# Altium schematic sheet DM2080_Connector_A.SchDoc: =project_title
size Tabloid; CompanyName: Luxonis Holding; Organization: Luxonis Holding; Address1: 1925 Harmony Park Drive; Address2: Westminster, CO; Address3: 80234; Address4: United States; SheetNumber: 3; SheetTotal: 12
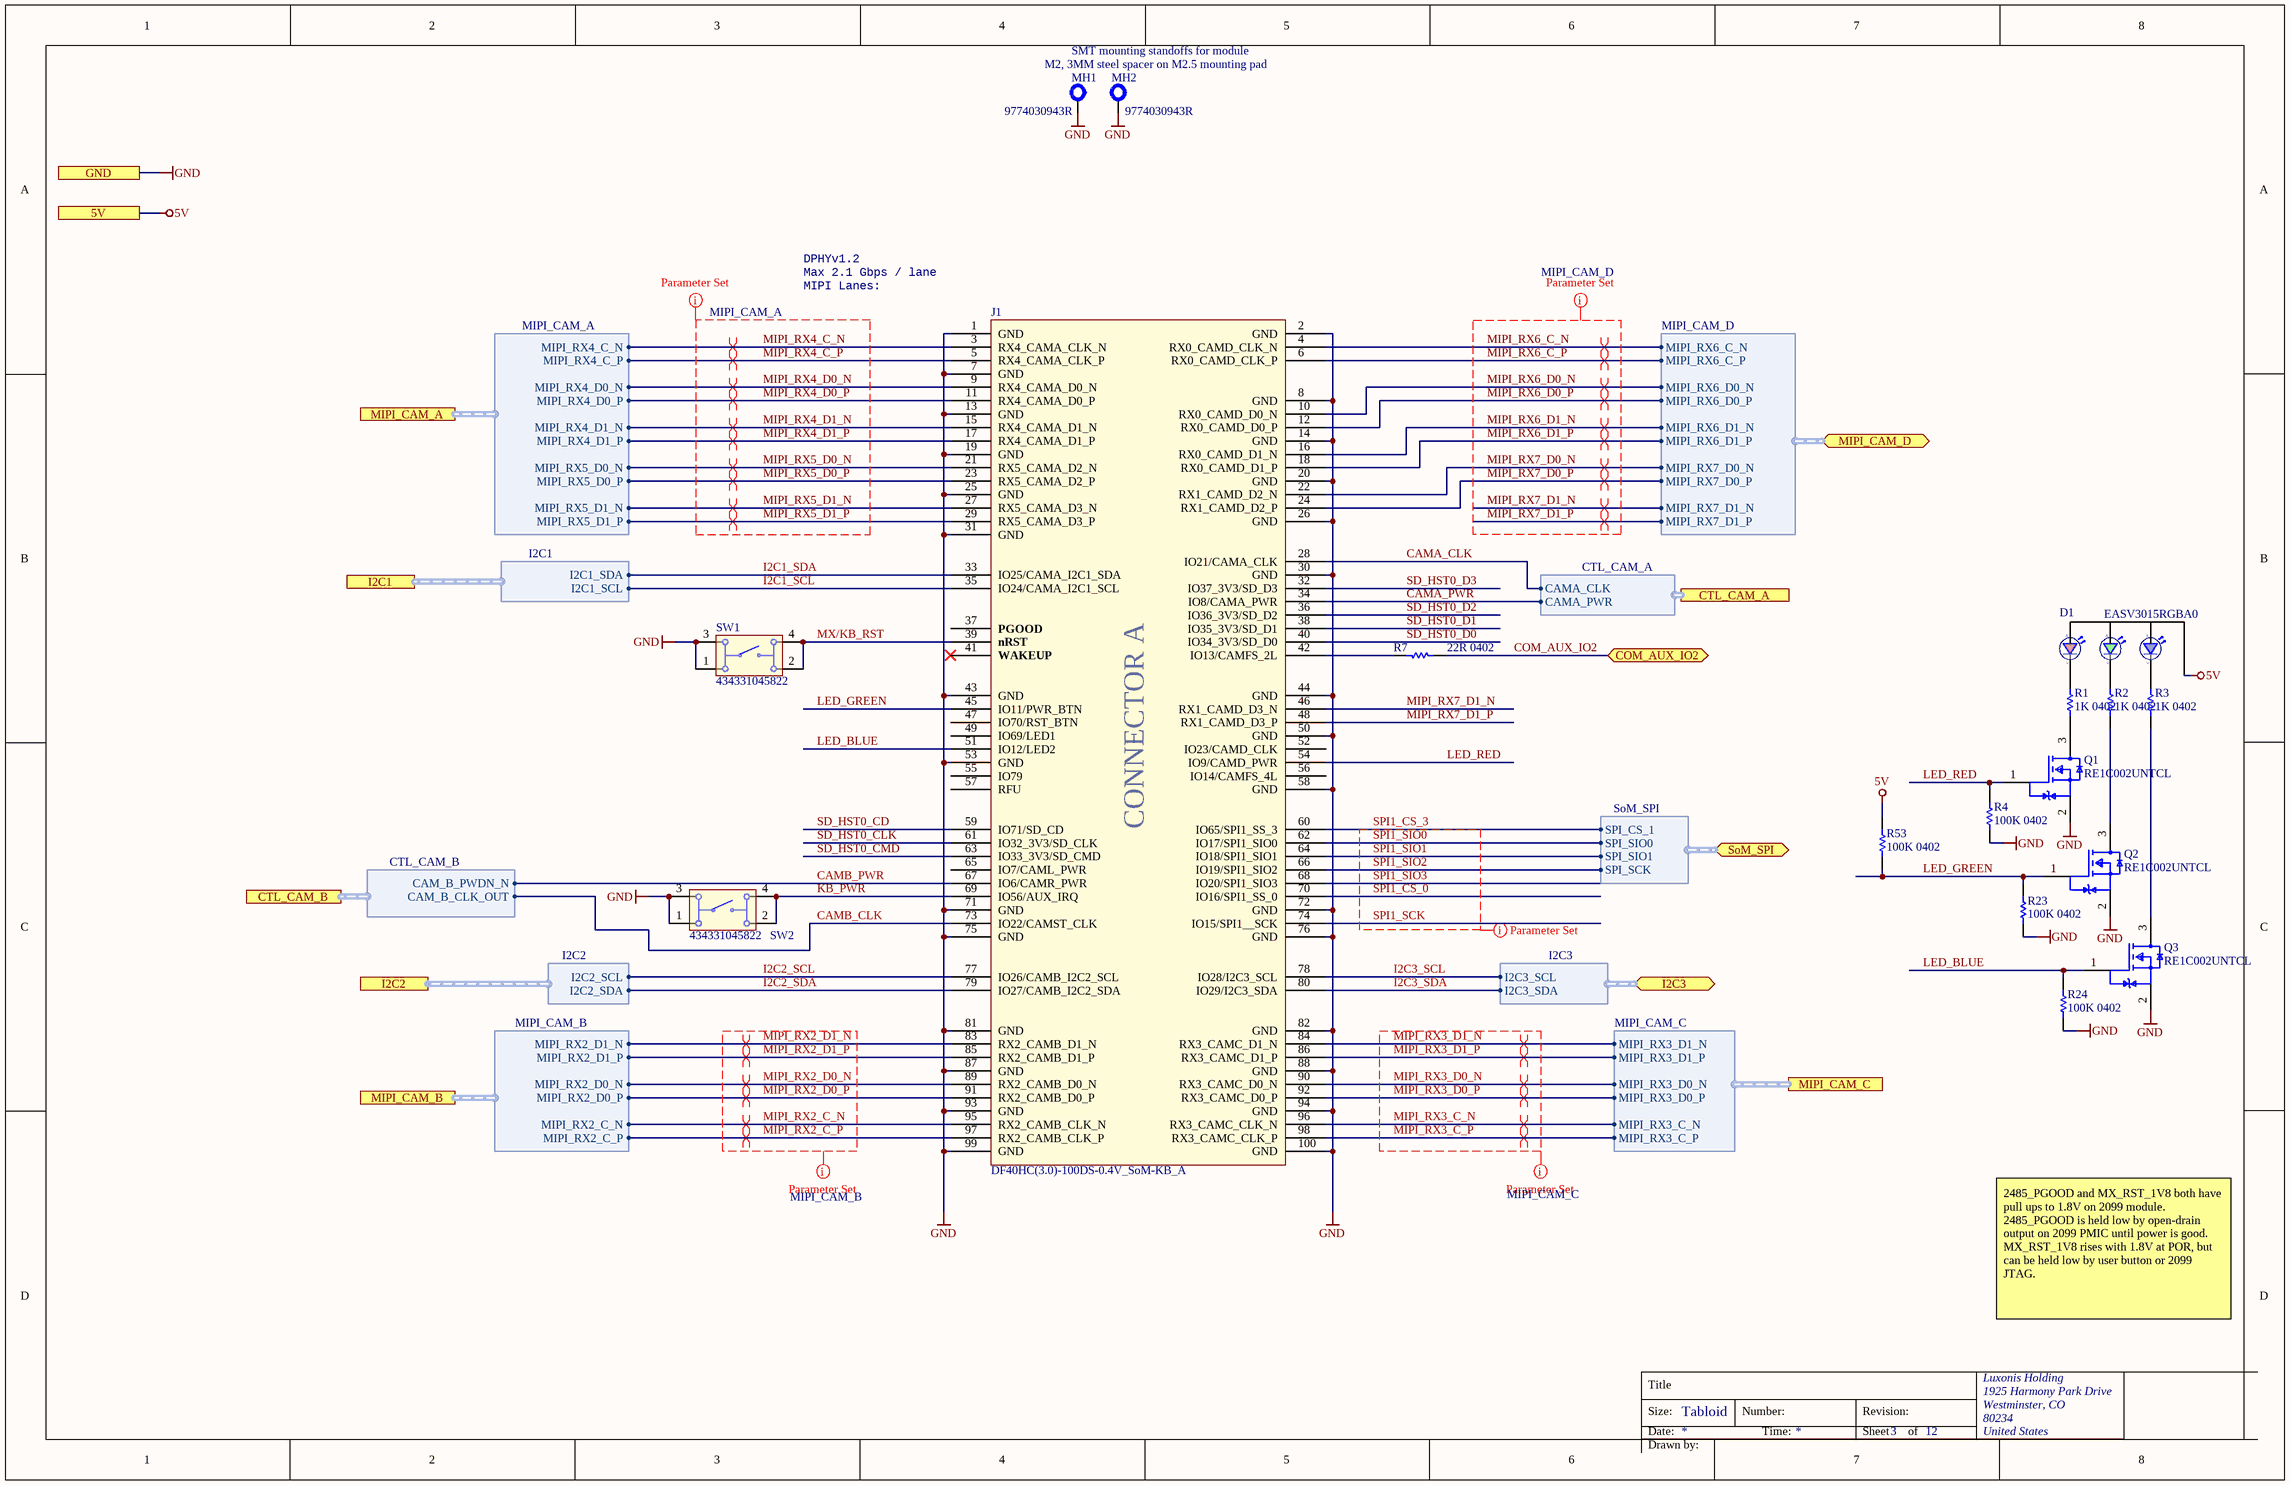
[diagram p0: DM2080_Connector_A.SchDoc]

## Parts
D1  EASV3015RGBA0  [EASV3015RGBA0]
J1  DF40HC(3.0)-100DS-0.4V_SoM-KB_A  [CON_A_SoM-Pro-KB_DF40HC-3.0-100DS-0.4V_minpad]
MH1  9774030943R  [9774030943R]
MH2  9774030943R  [9774030943R]
Q1  RE1C002UNTCL  [RE1C002UNTCL]
Q2  RE1C002UNTCL  [RE1C002UNTCL]
Q3  RE1C002UNTCL  [RE1C002UNTCL]
R1  1K 0402  [RESC0402(1005)_L]
R2  1K 0402  [RESC0402(1005)_L]
R3  1K 0402  [RESC0402(1005)_L]
R4  100K 0402  [RESC0402(1005)_L]
R7  22R 0402  [RESC0402(1005)_L]
R23  100K 0402  [RESC0402(1005)_L]
R24  100K 0402  [RESC0402(1005)_L]
R53  100K 0402  [RESC0402(1005)_L]
SW1  434331045822  [434331045822]
SW2  434331045822  [434331045822]

## Ports
5V, COM_AUX_IO2 (bidir), CTL_CAM_A (harness CTL_CAM_A), CTL_CAM_B (harness CTL_CAM_B), GND, I2C1 (harness I2C1), I2C2 (harness I2C2), I2C3 (bidir, harness I2C3), MIPI_CAM_A (harness MIPI_CAM_A), MIPI_CAM_B (harness MIPI_CAM_B), MIPI_CAM_C (harness MIPI_CAM_C), MIPI_CAM_D (bidir, harness MIPI_CAM_D), SoM_SPI (bidir, harness SoM_SPI)

## Harnesses
MIPI_CAM_B: MIPI_RX2_C_P, MIPI_RX2_C_N, MIPI_RX2_D0_P, MIPI_RX2_D0_N, MIPI_RX2_D1_P, MIPI_RX2_D1_N
MIPI_CAM_C: MIPI_RX3_C_P, MIPI_RX3_C_N, MIPI_RX3_D0_P, MIPI_RX3_D0_N, MIPI_RX3_D1_P, MIPI_RX3_D1_N
I2C1: I2C1_SDA, I2C1_SCL
CTL_CAM_B: CAM_B_CLK_OUT, CAM_B_PWDN_N
I2C2: I2C2_SDA, I2C2_SCL
MIPI_CAM_A: MIPI_RX4_C_P, MIPI_RX4_C_N, MIPI_RX4_D0_P, MIPI_RX4_D0_N, MIPI_RX4_D1_P, MIPI_RX4_D1_N, MIPI_RX5_D0_P, MIPI_RX5_D0_N, MIPI_RX5_D1_P, MIPI_RX5_D1_N
MIPI_CAM_D: MIPI_RX6_C_N, MIPI_RX6_C_P, MIPI_RX6_D0_N, MIPI_RX6_D0_P, MIPI_RX6_D1_N, MIPI_RX6_D1_P, MIPI_RX7_D0_N, MIPI_RX7_D0_P, MIPI_RX7_D1_N, MIPI_RX7_D1_P
I2C3: I2C3_SCL, I2C3_SDA
SoM_SPI: SPI_SIO0, SPI_SIO1, SPI_CS_1, SPI_SCK
CTL_CAM_A: CAMA_PWR, CAMA_CLK

## Nets
5V: D1.1(A) R53.1 ; port 5V
GND: J1.1(GND) J1.2(GND) J1.7(GND) J1.8(GND) J1.13(GND) J1.14(GND) J1.19(GND) J1.20(GND) J1.25(GND) J1.26(GND) J1.30(GND) J1.31(GND) J1.43(GND) J1.44(GND) J1.50(GND) J1.53(GND) J1.58(GND) J1.71(GND) J1.72(GND) J1.75(GND) J1.76(GND) J1.81(GND) J1.82(GND) J1.87(GND) J1.88(GND) J1.93(GND) J1.94(GND) J1.99(GND) J1.100(GND) MH1.1 MH2.1 Q1.2(Source) Q2.2(Source) Q3.2(Source) R4.2 R23.2 R24.2 SW1.1 SW1.3 SW2.1 SW2.3 ; port GND
CAMA_CLK: J1.28(IO21/CAMA_CLK) ; port CTL_CAM_A.CAMA_CLK
CAMA_PWR: J1.34(IO8/CAMA_PWR) ; port CTL_CAM_A.CAMA_PWR
CAMB_CLK: J1.73(IO22/CAMST_CLK) ; port CTL_CAM_B.CAM_B_CLK_OUT
CAMB_PWR: J1.67(IO6/CAMR_PWR) ; port CTL_CAM_B.CAM_B_PWDN_N
COM_AUX_IO2: R7.1 ; port COM_AUX_IO2
I2C1_SCL: J1.35(IO24/CAMA_I2C1_SCL) ; port I2C1.I2C1_SCL
I2C1_SDA: J1.33(IO25/CAMA_I2C1_SDA) ; port I2C1.I2C1_SDA
I2C2_SCL: J1.77(IO26/CAMB_I2C2_SCL) ; port I2C2.I2C2_SCL
I2C2_SDA: J1.79(IO27/CAMB_I2C2_SDA) ; port I2C2.I2C2_SDA
I2C3_SCL: J1.78(IO28/I2C3_SCL) ; port I2C3.I2C3_SCL
I2C3_SDA: J1.80(IO29/I2C3_SDA) ; port I2C3.I2C3_SDA
KB_PWR: J1.69(IO56/AUX_IRQ) SW2.2 SW2.4
LED_BLUE: J1.51(IO12/LED2) Q3.1(Gate) R24.1
LED_GREEN: J1.45(IO11/PWR_BTN) Q2.1(Gate) R23.1 R53.2
LED_RED: J1.54(IO9/CAMD_PWR) Q1.1(Gate) R4.1
MIPI_RX2_C_N: J1.95(RX2_CAMB_CLK_N) ; port MIPI_CAM_B.MIPI_RX2_C_N
MIPI_RX2_C_P: J1.97(RX2_CAMB_CLK_P) ; port MIPI_CAM_B.MIPI_RX2_C_P
MIPI_RX2_D0_N: J1.89(RX2_CAMB_D0_N) ; port MIPI_CAM_B.MIPI_RX2_D0_N
MIPI_RX2_D0_P: J1.91(RX2_CAMB_D0_P) ; port MIPI_CAM_B.MIPI_RX2_D0_P
MIPI_RX2_D1_N: J1.83(RX2_CAMB_D1_N) ; port MIPI_CAM_B.MIPI_RX2_D1_N
MIPI_RX2_D1_P: J1.85(RX2_CAMB_D1_P) ; port MIPI_CAM_B.MIPI_RX2_D1_P
MIPI_RX3_C_N: J1.96(RX3_CAMC_CLK_N) ; port MIPI_CAM_C.MIPI_RX3_C_N
MIPI_RX3_C_P: J1.98(RX3_CAMC_CLK_P) ; port MIPI_CAM_C.MIPI_RX3_C_P
MIPI_RX3_D0_N: J1.90(RX3_CAMC_D0_N) ; port MIPI_CAM_C.MIPI_RX3_D0_N
MIPI_RX3_D0_P: J1.92(RX3_CAMC_D0_P) ; port MIPI_CAM_C.MIPI_RX3_D0_P
MIPI_RX3_D1_N: J1.84(RX3_CAMC_D1_N) ; port MIPI_CAM_C.MIPI_RX3_D1_N
MIPI_RX3_D1_P: J1.86(RX3_CAMC_D1_P) ; port MIPI_CAM_C.MIPI_RX3_D1_P
MIPI_RX4_C_N: J1.3(RX4_CAMA_CLK_N) ; port MIPI_CAM_A.MIPI_RX4_C_N
MIPI_RX4_C_P: J1.5(RX4_CAMA_CLK_P) ; port MIPI_CAM_A.MIPI_RX4_C_P
MIPI_RX4_D0_N: J1.9(RX4_CAMA_D0_N) ; port MIPI_CAM_A.MIPI_RX4_D0_N
MIPI_RX4_D0_P: J1.11(RX4_CAMA_D0_P) ; port MIPI_CAM_A.MIPI_RX4_D0_P
MIPI_RX4_D1_N: J1.15(RX4_CAMA_D1_N) ; port MIPI_CAM_A.MIPI_RX4_D1_N
MIPI_RX4_D1_P: J1.17(RX4_CAMA_D1_P) ; port MIPI_CAM_A.MIPI_RX4_D1_P
MIPI_RX5_D0_N: J1.21(RX5_CAMA_D2_N) ; port MIPI_CAM_A.MIPI_RX5_D0_N
MIPI_RX5_D0_P: J1.23(RX5_CAMA_D2_P) ; port MIPI_CAM_A.MIPI_RX5_D0_P
MIPI_RX5_D1_N: J1.27(RX5_CAMA_D3_N) ; port MIPI_CAM_A.MIPI_RX5_D1_N
MIPI_RX5_D1_P: J1.29(RX5_CAMA_D3_P) ; port MIPI_CAM_A.MIPI_RX5_D1_P
MIPI_RX6_C_N: J1.4(RX0_CAMD_CLK_N) ; port MIPI_CAM_D.MIPI_RX6_C_N
MIPI_RX6_C_P: J1.6(RX0_CAMD_CLK_P) ; port MIPI_CAM_D.MIPI_RX6_C_P
MIPI_RX6_D0_N: J1.10(RX0_CAMD_D0_N) ; port MIPI_CAM_D.MIPI_RX6_D0_N
MIPI_RX6_D0_P: J1.12(RX0_CAMD_D0_P) ; port MIPI_CAM_D.MIPI_RX6_D0_P
MIPI_RX6_D1_N: J1.16(RX0_CAMD_D1_N) ; port MIPI_CAM_D.MIPI_RX6_D1_N
MIPI_RX6_D1_P: J1.18(RX0_CAMD_D1_P) ; port MIPI_CAM_D.MIPI_RX6_D1_P
MIPI_RX7_D0_N: J1.22(RX1_CAMD_D2_N) ; port MIPI_CAM_D.MIPI_RX7_D0_N
MIPI_RX7_D0_P: J1.24(RX1_CAMD_D2_P) ; port MIPI_CAM_D.MIPI_RX7_D0_P
MIPI_RX7_D1_N: J1.46(RX1_CAMD_D3_N) ; port MIPI_CAM_D.MIPI_RX7_D1_N
MIPI_RX7_D1_P: J1.48(RX1_CAMD_D3_P) ; port MIPI_CAM_D.MIPI_RX7_D1_P
MX/KB_RST: J1.39(nRST) SW1.2 SW1.4
SD_HST0_CD: J1.59(IO71/SD_CD)
SD_HST0_CLK: J1.61(IO32_3V3/SD_CLK)
SD_HST0_CMD: J1.63(IO33_3V3/SD_CMD)
SD_HST0_D0: J1.40(IO34_3V3/SD_D0)
SD_HST0_D1: J1.38(IO35_3V3/SD_D1)
SD_HST0_D2: J1.36(IO36_3V3/SD_D2)
SD_HST0_D3: J1.32(IO37_3V3/SD_D3)
SPI1_CS_0: J1.70(IO16/SPI1_SS_0)
SPI1_CS_3: J1.60(IO65/SPI1_SS_3) ; port SoM_SPI.SPI_CS_1
SPI1_SCK: J1.74(IO15/SPI1__SCK)
SPI1_SIO0: J1.62(IO17/SPI1_SIO0) ; port SoM_SPI.SPI_SIO0
SPI1_SIO1: J1.64(IO18/SPI1_SIO1) ; port SoM_SPI.SPI_SIO1
SPI1_SIO2: J1.66(IO19/SPI1_SIO2) ; port SoM_SPI.SPI_SCK
SPI1_SIO3: J1.68(IO20/SPI1_SIO3)
NetD1_2: D1.2(C) R3.2
NetD1_3: D1.3(C) R2.2
NetD1_4: D1.4(C) R1.2
NetJ1_42: J1.42(IO13/CAMFS_2L) R7.2
NetQ1_3: Q1.3(Drain) R1.1
NetQ2_3: Q2.3(Drain) R2.1
NetQ3_3: Q3.3(Drain) R3.1

Not connected (* = marked no-connect by the designer): J1 37(PGOOD) 41(WAKEUP)* 47(IO70/RST_BTN) 49(IO69/LED1) 52(IO23/CAMD_CLK) 55(IO79) 56(IO14/CAMFS_4L) 57(RFU) 65(IO7/CAML_PWR)

## Layout directives
net class MIPI_CAM_B; rule Matched Net Lengths [Delay Tolerance = 1ps]: MIPI_RX2_C_N, MIPI_RX2_C_P, MIPI_RX2_D0_N, MIPI_RX2_D0_P, MIPI_RX2_D1_N, MIPI_RX2_D1_P
differential pair; differential pair class 100ohm: MIPI_RX2_C_N, MIPI_RX2_C_P, MIPI_RX2_D0_N, MIPI_RX2_D0_P, MIPI_RX2_D1_N, MIPI_RX2_D1_P, MIPI_RX3_C_N, MIPI_RX3_C_P, MIPI_RX3_D0_N, MIPI_RX3_D0_P, MIPI_RX3_D1_N, MIPI_RX3_D1_P, MIPI_RX4_C_N, MIPI_RX4_C_P, MIPI_RX4_D0_N, MIPI_RX4_D0_P, MIPI_RX4_D1_N, MIPI_RX4_D1_P, MIPI_RX5_D0_N, MIPI_RX5_D0_P, MIPI_RX5_D1_N, MIPI_RX5_D1_P, MIPI_RX6_C_N, MIPI_RX6_C_P, MIPI_RX6_D0_N, MIPI_RX6_D0_P, MIPI_RX6_D1_N, MIPI_RX6_D1_P, MIPI_RX7_D0_N, MIPI_RX7_D0_P, MIPI_RX7_D1_N, MIPI_RX7_D1_P
net class MIPI_CAM_C; rule Matched Net Lengths [Delay Tolerance = 1ps]: MIPI_RX3_C_N, MIPI_RX3_C_P, MIPI_RX3_D0_N, MIPI_RX3_D0_P, MIPI_RX3_D1_N, MIPI_RX3_D1_P
net class SPI0: SPI1_CS_0, SPI1_CS_3, SPI1_SCK, SPI1_SIO0, SPI1_SIO1, SPI1_SIO2, SPI1_SIO3
net class MIPI_CAM_A; rule Matched Net Lengths [Delay Tolerance = 1ps]; rule Matched Net Lengths [Delay Tolerance = 0,5ps]: MIPI_RX4_C_N, MIPI_RX4_C_P, MIPI_RX4_D0_N, MIPI_RX4_D0_P, MIPI_RX4_D1_N, MIPI_RX4_D1_P, MIPI_RX5_D0_N, MIPI_RX5_D0_P, MIPI_RX5_D1_N, MIPI_RX5_D1_P
net class MIPI_CAM_D; rule Matched Net Lengths [Delay Tolerance = 1ps]; rule Matched Net Lengths [Delay Tolerance = 0,5ps]: MIPI_RX6_C_N, MIPI_RX6_C_P, MIPI_RX6_D0_N, MIPI_RX6_D0_P, MIPI_RX6_D1_N, MIPI_RX6_D1_P, MIPI_RX7_D0_N, MIPI_RX7_D0_P, MIPI_RX7_D1_N, MIPI_RX7_D1_P

## Notes on the sheet
- M2, 3MM steel spacer on M2.5 mounting pad
- SMT mounting standoffs for module
- MIPI Lanes:
- Max 2.1 Gbps / lane
- DPHYv1.2
- 2485_PGOOD and MX_RST_1V8 both have pull ups to 1.8V on 2099 module. 2485_PGOOD is held low by open-drain output on 2099 PMIC until power is good. MX_RST_1V8 rises with 1.8V at POR, but can be held low by user button or 2099 JTAG.
- Title
- Size:
- Date:
- Tabloid
- Number:
- Time:
- Revision:
- Sheet
- of
- Drawn by:
- (in symbol CMP-038-000000-5) CONNECTOR A

## Library data of the parts
D1 = EASV3015RGBA0: LED Tri-Color Blue/Green/Red 468nm/518nm/632nm 4-Pin SMD; Manufacturer 1: Everlight; Color: Blue,Green,Red; Lens Color: Colorless; Lens Transparency: Clear; Luminous Intensity: 50mcd; Test Current: 20mA; Viewing Angle: 100°; Dominant Wavelength: 470nm; Forward Voltage: 3.3V; Supplier 1: Future Electronics; RoHS: Yes; Category: LEDs; Mount: Surface Mount; Case/Package: SMD/SMT; Packaging: Tape and Reel; Length: 3mm; Width: 1.5mm; Height: 1.1mm; Lead Free: Lead Free; RoHS Compliant: Yes; ComponentLink1URL: https://everlightamericas.com/index.php?controller=attachment&id_attachment=1129&src-supplier=Digi-Key; ComponentLink1Description: https://everlightamericas.com/index.php?controller=attachment&id_attachment=1129&src-supplier=Digi-Key; ComponentLink2URL: https://everlightamericas.com/index.php?controller=attachment&amp;id_attachment=3220&src-supplier=Digi-Key; ComponentLink2Description: https://everlightamericas.com/index.php?controller=attachment&amp;id_attachment=3220&src-supplier=Digi-Key; ComponentLink3URL: https://everlightamericas.com/index.php?controller=attachment&id_attachment=3220&src-supplier=Digi-Key; ComponentLink3Description: https://everlightamericas.com/index.php?controller=attachment&id_attachment=3220&src-supplier=Digi-Key; Manufacturer Part Number 1: EASV3015RGBA0; Supplier Part Number 1: 9074476; Stock 1: 6000; Pricing 1: 2000=0,11600, 6000=0,09680, 10000=0,09580, 20000=0,09450, 40000=0,09310 (USD)
J1 = CMP-038-000000-5: OAK-SoM-Pro-S3 base board conn. A; Manufacturer 1: Hirose; Manufacturer Part Number 1: DF40HC(3.0)-100DS-0.4V(58); Pitch: 0.016inch; Number of Positions: 100; Connector Type: Receptacle; System: Connector; ComponentLink2URL: https://datasheet.ciiva.com/18562/ed-df40-20140305-18562189.pdf?src-supplier=Digi-Key; ComponentLink3Description: https://datasheet.ciiva.com/13559/ed-df40-20140305-13559540.pdf?src-supplier=Mouser; Packaging: Tape and Reel; Design Item ID: DF40HC(3.0)-100DS-0.4V_SoM-KB_A; Pricing 2: 1=2.50000, 10=2.40000, 25=2.10000, 50=2.10000, 100=2.00000, 250=1.76000, 500=1.71000, 1000=1.45000, 2000=1.36000, 5000=1.31000, 10000=1.31000 (USD); Package Quantity: 1000; Stock 2: 2078; Contact Plating: Gold; ComponentLink4Description: https://datasheet.ciiva.com/18562/ed-df40-20140305-18562462.pdf?src-supplier=Digi-Key; ComponentLink2Description: https://datasheet.ciiva.com/18562/ed-df40-20140305-18562189.pdf?src-supplier=Digi-Key; ComponentLink3URL: https://datasheet.ciiva.com/13559/ed-df40-20140305-13559540.pdf?src-supplier=Mouser; Mount: Surface Mount; Lead Free: Lead Free; ComponentLink4URL: https://datasheet.ciiva.com/18562/ed-df40-20140305-18562462.pdf?src-supplier=Digi-Key; ComponentLink1Description: https://datasheet.ciiva.com/46636/ed-df40-20140305-46636517.pdf?src-supplier=Digi-Key; Source: OAK-SoM-Pro-KB.SchLib; RoHS: Yes; Pricing 1: 1=2.54000, 10=2.26000, 25=2.07000, 50=2.07000, 100=1.98000, 250=1.79000, 500=1.65000, 1000=1.41000, 3000=1.32000, 6000=1.23000, 10000=1.23000 (USD); Stock 1: 2172; Number of Rows: 2; ComponentLink1URL: https://datasheet.ciiva.com/46636/ed-df40-20140305-46636517.pdf?src-supplier=Digi-Key
MH1 MH2 = CMP-090-000000-1: Spacers/Standoffs; Manufacturer 1: Wurth Electronics; Pricing 1: 1=0,81000, 10=0,75600, 50=0,70200, 100=0,62100 (USD); ComponentLink3URL: http://www.farnell.com/datasheets/2305586.pdf?src-supplier=Element14; Stock 1: 354; Category: Spacers, Standoffs; Manufacturer Part Number 1: 9774030943R; ComponentLink2URL: http://www.farnell.com/datasheets/2305586.pdf?src-supplier=Newark; ComponentLink3Description: http://www.farnell.com/datasheets/2305586.pdf?src-supplier=Element14; ComponentLink1URL: https://katalog.we-online.de/em/datasheet/9774030943.pdf?src-supplier=Digi-Key; Design Item ID: 9774030943R; Source: DM2097_R1M1E1.SCHLIB; ComponentLink1Description: https://katalog.we-online.de/em/datasheet/9774030943.pdf?src-supplier=Digi-Key; ComponentLink2Description: http://www.farnell.com/datasheets/2305586.pdf?src-supplier=Newark; RoHS: Yes
Q1-Q3 = RE1C002UNTCL: MOSFET N-CH 20V 0.2A EMT3; Manufacturer 1: Rohm; Continuous Drain Current (ID): 200mA; Rds On Max: 1.2R; Input Capacitance: 25pF; Max Power Dissipation: 150mW; RoHS: Yes; Mount: Surface Mount; Case/Package: SOT-89; Packaging: Tape and Reel; Drain to Source Voltage (Vdss): 20V; Lead Free: Lead Free; ComponentLink1URL: http://www.mouser.com/ds/2/348/re1c002untcl-e-1018231.pdf?src-supplier=Mouser; ComponentLink1Description: http://www.mouser.com/ds/2/348/re1c002untcl-e-1018231.pdf?src-supplier=Mouser; ComponentLink2URL: http://rohmfs.rohm.com/en/techdata_basic/transistor/taping/EMT3_TL_taping.pdf?src-supplier=Digi-Key; ComponentLink2Description: http://rohmfs.rohm.com/en/techdata_basic/transistor/taping/EMT3_TL_taping.pdf?src-supplier=Digi-Key; ComponentLink3URL: http://rohmfs.rohm.com/en/products/databook/datasheet/discrete/transistor/mosfet/re1c002un.pdf?src-supplier=Avnet; ComponentLink3Description: http://rohmfs.rohm.com/en/products/databook/datasheet/discrete/transistor/mosfet/re1c002un.pdf?src-supplier=Avnet; ComponentLink4URL: https://www.rohm.com/datasheet/RE1C002UN/re1c002untcl-e?src-supplier=Digi-Key; ComponentLink4Description: https://www.rohm.com/datasheet/RE1C002UN/re1c002untcl-e?src-supplier=Digi-Key; ComponentLink5URL: http://www.farnell.com/datasheets/2704376.pdf?src-supplier=Newark; ComponentLink5Description: http://www.farnell.com/datasheets/2704376.pdf?src-supplier=Newark; ComponentLink6URL: http://www.farnell.com/datasheets/2704376.pdf?src-supplier=Farnell; ComponentLink6Description: http://www.farnell.com/datasheets/2704376.pdf?src-supplier=Farnell; ComponentLink7URL: http://www.farnell.com/datasheets/2704376.pdf?src-supplier=Element14; ComponentLink7Description: http://www.farnell.com/datasheets/2704376.pdf?src-supplier=Element14; Supplier 1: Digi-Key; Manufacturer Part Number 1: RE1C002UNTCL; Stock 1: 868886; Pricing 1: 1=0.20000, 10=0.18200, 100=0.09930, 500=0.06112, 1000=0.04167 (USD); Supplier Part Number 1: RE1C002UNTCLCT-ND
R1-R3 = RC0402FR-071KL: RES SMD 1K OHM 1% 1/16W 0402; Manufacturer 1: Yageo; Temperature Coefficient: 100ppm/°C; Power Rating: 62.5mW; Voltage Rating (DC): 50V; Resistance: 1kR; RoHS: Yes; Number of Pins: 2; Case Code (Imperial): 0402; Case Code (Metric): 1005; Min Operating Temperature: -55°C; Max Operating Temperature: 155°C; Packaging: Tape and Reel; Composition: Thick Film; Voltage Rating: 50V; Military Standard: Not; Termination: SMD/SMT; Length: 1mm; Height: 0.32mm; Width: 0.5mm; Depth: 0.5mm; Lead Free: Lead Free; REACH SVHC: Unknown; ComponentLink1URL: https://datasheet.ciiva.com/11819/0900766b80c66297-11819477.pdf?src-supplier=RSComponents; ComponentLink1Description: https://datasheet.ciiva.com/11819/0900766b80c66297-11819477.pdf?src-supplier=RSComponents; ComponentLink2URL: https://datasheet.ciiva.com/12666/pyu-rc0402-51-rohs-l-6-r-12666741.pdf?src-supplier=Mouser; ComponentLink2Description: https://datasheet.ciiva.com/12666/pyu-rc0402-51-rohs-l-6-r-12666741.pdf?src-supplier=Mouser; ComponentLink3URL: https://datasheet.ciiva.com/17063/pyu-rc0402-51-rohs-l-6-r-17063193.pdf?src-supplier=Future+Electronics; ComponentLink3Description: https://datasheet.ciiva.com/17063/pyu-rc0402-51-rohs-l-6-r-17063193.pdf?src-supplier=Future+Electronics; ComponentLink4URL: https://datasheet.ciiva.com/22747/1018594-22747513.pdf?src-supplier=Element14; ComponentLink4Description: https://datasheet.ciiva.com/22747/1018594-22747513.pdf?src-supplier=Element14; ComponentLink5URL: https://datasheet.ciiva.com/7849/1018594-7849869.pdf?src-supplier=Element14; ComponentLink5Description: https://datasheet.ciiva.com/7849/1018594-7849869.pdf?src-supplier=Element14; ComponentLink6URL: https://datasheet.ciiva.com/7983/1018594-7983502.pdf?src-supplier=Element14; ComponentLink6Description: https://datasheet.ciiva.com/7983/1018594-7983502.pdf?src-supplier=Element14; ComponentLink7URL: https://datasheet.ciiva.com/7849/1018594-7849871.pdf?src-supplier=Element14; ComponentLink7Description: https://datasheet.ciiva.com/7849/1018594-7849871.pdf?src-supplier=Element14; Supplier 1: Digi-Key; Manufacturer Part Number 1: RC0402FR-071KL; Stock 1: 60695854; Pricing 1: 1=0.10000, 10=0.01600, 100=0.00670, 1000=0.00301, 2500=0.00261, 5000=0.00215 (USD); Case/Package: 0402; Tolerance: 1%; Supplier Part Number 1: 311-1.00KLRCT-ND
R4 R23 R24 R53 = CMP-013-000035-2: RES SMD 100K OHM 1% 1/16W 0402; Manufacturer 1: Yageo; Manufacturer Part Number 1: RC0402FR-07100KL; Voltage Rating: 50V; Power Rating: 63mW; Resistance: 100kR; Length: 0.039inch; Height: 0.016inch; Tolerance: 1%; Case/Package: 0402; Design Item ID: RC0402FR-07100KL; Max Power Dissipation: 63mW; Case Code (Metric): 1005; Max Operating Temperature: 155°C; Min Operating Temperature: -55°C; Case Code (Imperial): 0402; Depth: 0.5mm
R7 = RC0402FR-0722RL: RES SMD 22 OHM 1% 1/16W 0402; Manufacturer 1: Yageo; Temperature Coefficient: 100ppm/°C; Power Rating: 63mW; Voltage Rating: 50V; Supplier 1: Digi-Key; Manufacturer Part Number 1: RC0402FR-0722RL; Stock 1: 23751364; Pricing 1: 10000=0.00163, 30000=0.00144, 50000=0.00132, 100000=0.00129 (USD); RoHS: Yes; Case/Package: 0402; Number of Pins: 2; Case Code (Metric): 1005; Case Code (Imperial): 0402; Min Operating Temperature: -55°C; Max Operating Temperature: 155°C; Tolerance: 1%; Resistance: 22R; Packaging: Tape and Reel; Composition: Thick Film; Voltage Rating (DC): 50V; Termination: SMD/SMT; Military Standard: Not; Length: 1mm; Height: 0.32mm; Width: 0.5mm; Depth: 0.5mm; REACH SVHC: Unknown; Lead Free: Lead Free; ComponentLink1URL: https://datasheet.ciiva.com/11819/0900766b80c66297-11819462.pdf?src-supplier=RSComponents; ComponentLink1Description: https://datasheet.ciiva.com/11819/0900766b80c66297-11819462.pdf?src-supplier=RSComponents; ComponentLink2URL: https://datasheet.ciiva.com/7849/1018594-7849911.pdf?src-supplier=Element14; ComponentLink2Description: https://datasheet.ciiva.com/7849/1018594-7849911.pdf?src-supplier=Element14; ComponentLink3URL: https://datasheet.ciiva.com/26829/getdatasheetpartid-554995-26829991.pdf?src-supplier=Verical; ComponentLink3Description: https://datasheet.ciiva.com/26829/getdatasheetpartid-554995-26829991.pdf?src-supplier=Verical; ComponentLink4URL: https://datasheet.ciiva.com/7849/1018594-7849912.pdf?src-supplier=Element14; ComponentLink4Description: https://datasheet.ciiva.com/7849/1018594-7849912.pdf?src-supplier=Element14; ComponentLink5URL: https://datasheet.ciiva.com/16930/pyu-rc0402-51-rohs-l-6-r-16930687.pdf?src-supplier=Future+Electronics; ComponentLink5Description: https://datasheet.ciiva.com/16930/pyu-rc0402-51-rohs-l-6-r-16930687.pdf?src-supplier=Future+Electronics; Supplier 2: Newark; Supplier 3: Mouser; Supplier Part Number 2: 26M6784; Supplier Part Number 3: 603-RC0402FR-0722RL; Supplier Part Number 1: 311-22.0LRTR-ND
SW1 SW2 = CMP-011-00016-3: Keypad Switch, 1 Switches, SPST, Momentary-tactile, 0.05A, 12VDC, 2.65N, Solder Terminal, Surface Mount-right Angle; Manufacturer 1: Wurth Electronics; Voltage Rating: 12V; Max Current Rating: 50mA; Throw Configuration: SPST-NO; Supplier Part Number 1: 732-7055-2-ND; Manufacturer part number 1: 434331045822; Pins: 4; Supplier 1: Digi-Key; Current Rating: 50mA; Mounting Technology: SMD; Case/Package: 434331045822